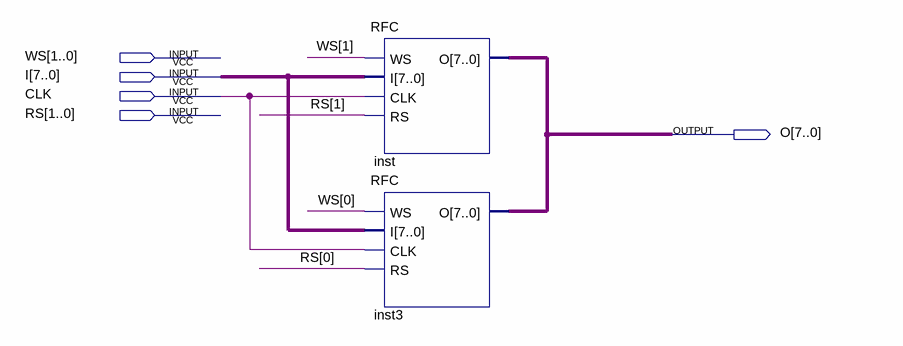
[diagram p0: schematic sheet]
// Quartus schematic RegisterFile.bdf as structural Verilog: 2 symbols, 5 pins
module RegisterFile (
  input  [1:0] WS,
  input  [7:0] I,
  input  CLK,
  input  [1:0] RS,
  output [7:0] O
);

  RFC inst (.WS(WS[1]), .I(I), .CLK(CLK), .RS(RS[1]), .O(O));
  RFC inst3 (.WS(WS[0]), .I(I), .CLK(CLK), .RS(RS[0]), .O(O));
endmodule
